# EasyEDA Pro project ProPrj_air-purifier_2025-10-16.epro

# Schematic Schematic1
Board Name: Board1; Create Date: 2025-08-24; Page Name: P1; Project Name: air-purifier; Schematic Name: Schematic1; Update Date: 2025-10-10; Company: EasyEDA.com; Page Size: A4; Version: V1.0
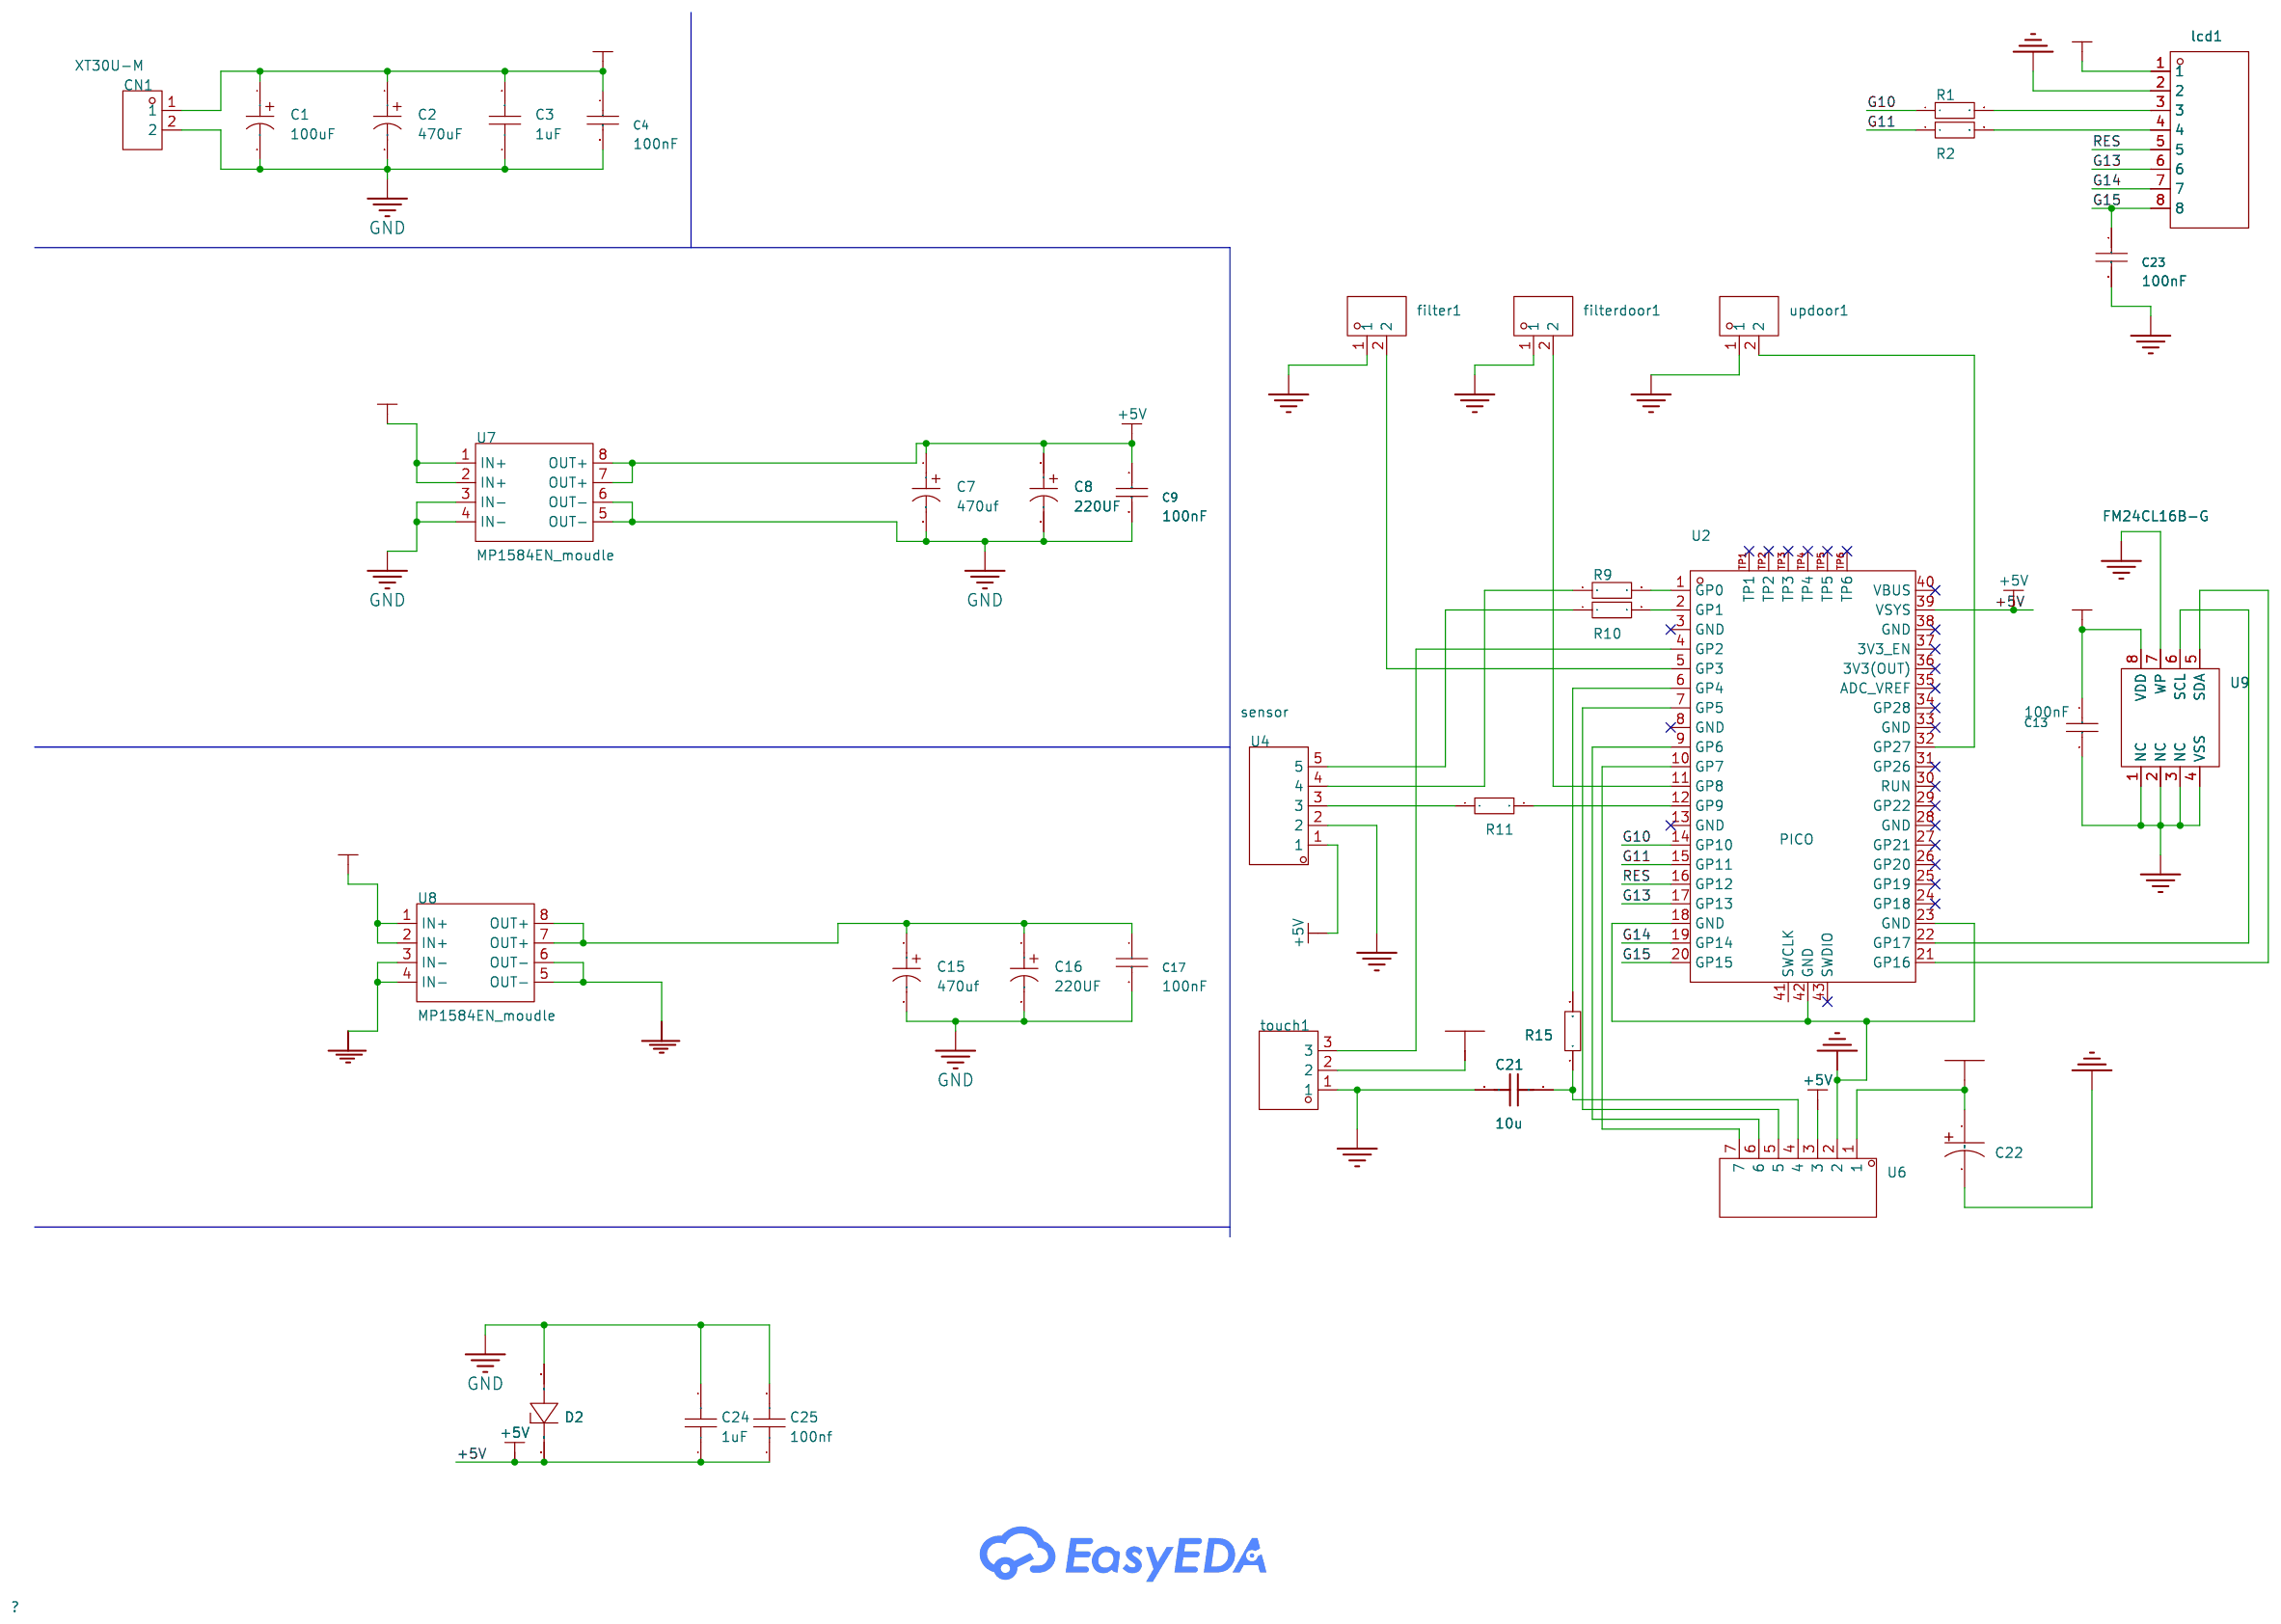
[diagram p0: schematic sheet]

## Parts
C1  100uF  [CAP-TH_BD8.0-P3.50-D0.5-FD]
C2  470uF  [CAP-TH_BD10.0-P5.00-D0.6-FD]
C3  1uF  [RES-SMD_L3.0-W1.5_HOT1206-2W-0R]
C4  100nF  [C1206]
C7  470uf  [CAP-TH_BD10.0-P5.00-D0.6-FD]
C8  220UF  [CAP-TH_BD8.0-P3.50-D0.5-FD]
C9  100nF  [C1206]
C13  100nF  [C1206]
C15  470uf  [CAP-TH_BD10.0-P5.00-D0.6-FD]
C16  220UF  [CAP-TH_BD8.0-P3.50-D0.5-FD]
C17  100nF  [C1206]
C21  10u  [C1206]
C22  1000uF  [CAP-TH_BD13.0-P5.00-D1.2-FD]
C23  100nF  [C1206]
C24  1uF  [C1206]
C25  100nf  [C1206]
CN1  XT30U-M  [CONN-TH_XT30U-M]
D2  SMBJ5.0A-Q  [SMBJ5.0A]
filter1  B2B-PH-K-S  [CONN-TH_B2B-PH-K-S]
filterdoor1  B2B-PH-K-S  [CONN-TH_B2B-PH-K-S]
lcd1  -  [CONN-TH_B8B-PH-K-S-LF-SN]
R1  330Ω  [R1206]
R2  330Ω  [R1206]
R9  1k  [C1206]
R10  1k  [R1206]
R11  10k  [R1206]
R15  1kΩ  [R1206]
touch1  -  [CONN-TH_B3B-PH-KL-LF-SN]
U2  PICO  [todbot_RPI_Pico:RPi_Pico_SMD]
U4  sensor  [CONN-TH_B5B-PH-K-S-LF-SN]
U6  -  [CONN-TH_B7B-PH-K-S-LF-SN]
U7  MP1584EN_moudle  [PWRM-TH_MP1584EN_MOUDLE]
U8  MP1584EN_moudle  [PWRM-TH_MP1584EN_MOUDLE]
U9  FM24CL16B-G  [SOIC-8_L4.9-W3.9-P1.27-LS6.0-BL]
updoor1  B2B-PH-K-S  [CONN-TH_B2B-PH-K-S]

## Library data of the parts
C1 = 100UF50VF120GF: Capacitance:100uF Tolerance:±20% Tolerance:±20% Voltage Rating:50V Ripple Current:550mA@100KHz Equivalent Series Resistance(ESR):170mΩ Pin Spacing:3.5mm Diameter:8mm Height - Seated (Max):12mm Lifetime:4000hrs@105℃ Operating Temperature:-40℃~+105℃ Operati; LCSC Part Name: 100uF ±20% 50V; Supplier Part: C46867072; Manufacturer: Econd(米朗电子); Supplier Footprint: 插件,D8xL12mm; Datasheet: https://atta.szlcsc.com/upload/public/pdf/source/20250321/B9ED006D79D4CBB252CF6B54793BD6AA.pdf; Supplier: LCSC; Tolerance: ±20%; Voltage Rating: 50V; Ripple Current: 550mA@100KHz; Equivalent Series Resistance(ESR): 170mΩ; Pin Spacing: 3.5mm; Diameter: 8mm; Height - Seated (Max): 12mm; Lifetime: 4000hrs@105℃; Operating Temperature: -40℃~+105℃
C2 = 50V470uF CD288: Capacitance:470uF Tolerance:±20% Tolerance:±20% Voltage Rating:50V Pin Spacing:5mm Diameter:10mm Height - Seated (Max):20mm Operating Temperature:-40℃~+105℃ Operating Temperature:-40℃~+105℃; LCSC Part Name: 470uF ±20% 50V; Supplier Part: C2960279; Manufacturer: HRK(鸿瑞凯电子); Supplier Footprint: 插件,D10xL20mm; JLCPCB Part Class: Extended Part; Supplier: LCSC; Tolerance: ±20%; Voltage Rating: 50V; Pin Spacing: 5mm; Diameter: 10mm; Height - Seated (Max): 20mm; Operating Temperature: -40℃~+105℃
C3 C24 C25 = CL31B105KBHNNNE: Capacitance:1uF Tolerance:±10% Tolerance:±10% Voltage Rating:50V Temperature Coefficient:X7R; LCSC Part Name: 1uF ±10% 50V; Supplier Part: C1848; Manufacturer: SAMSUNG(三星); Supplier Footprint: 1206; JLCPCB Part Class: Basic Part; Datasheet: https://item.szlcsc.com/datasheet/CL31B105KBHNNNE/2200.html; Supplier: LCSC; Tolerance: ±10%; Voltage Rating: 50V; Temperature Coefficient: X7R
C4 C9 C13 C17 C23 = CL31B104KBCNNNC: Capacitance:100nF Tolerance:±10% Tolerance:±10% Voltage Rating:50V Temperature Coefficient:X7R; LCSC Part Name: 100nF ±10% 50V; Supplier Part: C24497; Manufacturer: SAMSUNG(三星); Supplier Footprint: 1206; Datasheet: https://item.szlcsc.com/datasheet/CL31B104KBCNNNC/25237.html; Supplier: LCSC; Tolerance: ±10%; Voltage Rating: 50V; Temperature Coefficient: X7R
C7 C8 C15 C16 = 330uF-RB/2.5*6.3: Supplier Part: C9900010440; Supplier Footprint: CAP-TH_BD6.3-P2.50; JLCPCB Part Class: Extended Part; Supplier: LCSC
C21 = 10u: Manufacturer Part: ?; nameAlias: Value(F); spicePre: C; spiceSymbolName: Capacitor
C22 = GR108M050J25RR0VZ2FP0: Lead Spacing: φD: Lifetime @ Temp: Rated Voltage: Tolerance: L: Capacitance: Operating Temperature:- Operating Temperature:-; LCSC Part Name: 1000uF 50V; Supplier Part: C99506; Manufacturer: CX(承兴); Supplier Footprint: 径向引线,13x25mm; JLCPCB Part Class: Extended Part; Datasheet: https://atta.szlcsc.com/upload/public/pdf/source/20180207/C99506_15179953887441359498.pdf; Supplier: LCSC
CN1 = XT30U-M: Power:- Output:- Input:- Size:- Interface:- Type:- Colour:Yellow MaximumCurrent:- Type:Plug RatedVoltage:- Type1:- NumberOfUSBHoles:- InterfaceType:Male MetalMaterial:- InsulationMaterial:- RatedCurrent:- RecommendedWireGauge:- FlameRetardantGrade:- conta; LCSC Part Name: AMASS(艾迈斯)轻量版锂电池插头公头 XT30U-M; Supplier Part: C99101; Manufacturer: AMASS(艾迈斯); JLCPCB Part Class: Extended Part; Datasheet: https://item.szlcsc.com/datasheet/XT30U-M/100314.html; Supplier: LCSC; Type: Plug; Colour: Yellow; InterfaceType: Male
D2 = SMBJ5.0A-Q
filter1 filterdoor1 updoor1 = B2B-PH-K-S: Pins Structure:1x2P Pitch:2mm Mounting Style:Direct Insert Reference Series:PH Number of Pins:2P Number of Rows:1 Number of PINs Per Row:2 Row Spacing:- Current Rating (Max):2A Contact Material:Brass Contact Plating:Tin Operating Temperature Range:-25℃~+8; LCSC Part Name: 1x2P 间距:2mm 直插 系列:PH; Supplier Part: C20504437; Manufacturer: JST; Supplier Footprint: 插件,P=2mm; JLCPCB Part Class: Extended Part; Datasheet: https://atta.szlcsc.com/upload/public/pdf/source/20181010/C265101_22107ACC4D8714694FDA2DD97145FA81.pdf; Supplier: LCSC; Pins Structure: 1x2P; Pitch: 2mm; Mounting Style: Direct Insert; Reference Series: PH; Number of Pins: 2P; Number of Rows: 1; Number of PINs Per Row: 2; Current Rating (Max): 2A; Contact Material: Brass; Contact Plating: Tin; Operating Temperature Range: -25℃~+85℃; Rated Voltage (Max): 100V; Plastic Material: PA66; Flame Retardant Rating: UL94V-0; Supplementary Features: K-leg punch; Colour: White; Z-Height of the Board: 6mm; X-Length of Bottom Edge on Board (Spacing Line): 5.9mm; Y-Width of Bottom Edge on Board: 4.5mm
lcd1 = B8B-XH-A(LF)(SN): Reference Series:XH Pitch:2.5mm Pins Structure:1x8P Number of Rows:1 Number of PINs Per Row:8 Row Spacing:- Mounting Style:- Contact Material:Brass; LCSC Part Name: XH插座 1*8P 直针 间距2.5mm; Supplier Part: C157972; Manufacturer: JST; Supplier Footprint: 插件,P=2.5mm; JLCPCB Part Class: Extended Part; Datasheet: https://atta.szlcsc.com/upload/public/pdf/source/20180319/75EEE5A04AFFC29AA09923EB072E152C.pdf; Supplier: LCSC; Reference Series: XH; Pitch: 2.5mm; Pins Structure: 1x8P; Number of Rows: 1; Number of PINs Per Row: 8; Contact Material: Brass
R1 R2 R9-R11 R15 = RC1206FR-07120KL: Resistance: Operating Temperature Range: Operating Temperature Range: Power(Watts):250mW Body Length:- Tolerance: φD:- Body Height:- Body Width:- Type:Thick Film Resistors Temperature Coefficient: Temperature Coefficient: Overload Voltage (Max):; LCSC Part Name: 120kΩ ±1%; Supplier Part: C163387; Manufacturer: YAGEO(国巨); Supplier Footprint: 1206; JLCPCB Part Class: Extended Part; Datasheet: https://atta.szlcsc.com/upload/public/pdf/source/20180111/C163387_15156543892491258908.pdf; Supplier: LCSC; Power(Watts): 250mW; Type: Thick Film Resistors
touch1 = B3B-ZR(LF)(SN): Reference Series:ZH Pitch:1.5mm Pins Structure:1x3P Number of Rows:1 Number of PINs Per Row:3 Row Spacing:- Mounting Style:- Contact Material:Brass; LCSC Part Name: ZH系列 插座 1*3P 间距1.5mm 直针; Supplier Part: C158001; Manufacturer: JST; Supplier Footprint: 插件,P=1.5mm; JLCPCB Part Class: Extended Part; Datasheet: https://atta.szlcsc.com/upload/public/pdf/source/20180403/C158001_DEF8CA1D6A7E5EA35CC848DFD033606F.pdf; Supplier: LCSC; Reference Series: ZH; Pitch: 1.5mm; Pins Structure: 1x3P; Number of Rows: 1; Number of PINs Per Row: 3; Contact Material: Brass
U2 = PICO: Supplier Part: C7203002; Manufacturer: Raspberry Pi(树莓派); JLCPCB Part Class: Extended Part; Datasheet: https://atta.szlcsc.com/upload/public/pdf/source/20230906/086376002DDC9866828648BC93E51F8B.pdf; Supplier: LCSC
U4 = B5B-PH-K-S(LF)(SN): Pins Structure:1x5P Pitch:2mm Mounting Style:Direct Insert Reference Series:PH Number of Pins:5P Number of Rows:1 Number of PINs Per Row:5 Row Spacing:- Current Rating (Max):2A Contact Material:Brass Contact Plating:Tin Operating Temperature Range:-25℃~+8; LCSC Part Name: 1x5P 间距:2mm 直插 系列:PH; Supplier Part: C157993; Manufacturer: JST; Supplier Footprint: 插件,P=2mm; JLCPCB Part Class: Extended Part; Datasheet: https://atta.szlcsc.com/upload/public/pdf/source/20181010/C265101_22107ACC4D8714694FDA2DD97145FA81.pdf; Supplier: LCSC; Pins Structure: 1x5P; Pitch: 2mm; Mounting Style: Direct Insert; Reference Series: PH; Number of Pins: 5P; Number of Rows: 1; Number of PINs Per Row: 5; Current Rating (Max): 2A; Contact Material: Brass; Contact Plating: Tin; Operating Temperature Range: -25℃~+85℃; Rated Voltage (Max): 100V; Plastic Material: PA66; Flame Retardant Rating: UL94V-0; Supplementary Features: K-leg punch; Colour: White; Z-Height of the Board: 6mm; X-Length of Bottom Edge on Board (Spacing Line): 11.9mm; Y-Width of Bottom Edge on Board: 4.5mm
U6 = B7B-PH-K-S(LF)(SN): Reference Series:PH Pitch:2mm Pins Structure:1x7P Number of Rows:1 Number of PINs Per Row:7 Row Spacing:- Mounting Style:- Contact Material:Brass; LCSC Part Name: PH插座 1*7P 直针 间距2mm; Supplier Part: C157981; Manufacturer: JST; Supplier Footprint: 插件,P=2mm; JLCPCB Part Class: Extended Part; Datasheet: https://atta.szlcsc.com/upload/public/pdf/source/20180531/C157981_0AB98A862CF95B0630A5741FEF846F01.pdf; Supplier: LCSC; Reference Series: PH; Pitch: 2mm; Pins Structure: 1x7P; Number of Rows: 1; Number of PINs Per Row: 7; Contact Material: Brass
U7 U8 = MP1584EN_moudle: Supplier Part: C9900223542; Supplier Footprint: 插件; Supplier: LCSC
U9 = FM24CL16B-G: LCSC Part Name: FM24CL16B G; Supplier Part: C1350846; Supplier Footprint: SOIC-8; JLCPCB Part Class: Extended Part; Supplier: LCSC

## Nets
24V: C1.1 C2.1 C3.2 C4.1 C22.1 CN1.1 U6.1 U7.1(IN+) U7.2(IN+) U8.1(IN+) U8.2(IN+)
+3V3: C13.1 C15.1 C16.1 C17.1 lcd1.1 touch1.2 U8.7(OUT+) U8.8(OUT+) U9.8(VDD)
+5V: C7.1 C8.1 C9.1 C24.1 C25.1 D2.1(CATHODE) U2.39(VSYS) U4.1 U6.3 U7.7(OUT+) U7.8(OUT+)
GND: C1.2 C2.2 C3.1 C4.2 C7.2 C8.2 C9.2 C13.2 C15.2 C16.2 C17.2 C21.2 C22.2 C23.2 C24.2 C25.2 CN1.2 D2.2(ANODE) filter1.1 filterdoor1.1 lcd1.2 touch1.1 U2.18(GND) U2.23(GND) U2.42(GND) U4.2 U6.2 U7.3(IN-) U7.4(IN-) U7.5(OUT-) U7.6(OUT-) U8.3(IN-) U8.4(IN-) U8.5(OUT-) U8.6(OUT-) U9.1(NC) U9.2(NC) U9.3(NC) U9.4(VSS) U9.7(WP) updoor1.1
G10: R1.1 U2.14(GP10)
G11: R2.1 U2.15(GP11)
G13: lcd1.6 U2.17(GP13)
G14: lcd1.7 U2.19(GP14)
G15: C23.1 lcd1.8 U2.20(GP15)
RES: lcd1.5 U2.16(GP12)
$1N4220: filter1.2 U2.5(GP3)
$1N4228: filterdoor1.2 U2.11(GP8)
$1N4378: U2.32(GP27) updoor1.2
$1N4437: R9.1 U4.4
$1N4598: touch1.3 U2.4(GP2)
$1N4710: U2.10(GP7) U6.7
$1N4720: U2.9(GP6) U6.6
$1N4731: U2.7(GP5) U6.5
$1N4885: R10.1 U4.5
$1N4888: R10.2 U2.2(GP1)
$1N4942: R9.2 U2.1(GP0)
$1N4987: R11.2 U2.12(GP9)
$1N4990: R11.1 U4.3
$1N5219: U2.21(GP16) U9.5(SDA)
$1N5233: U2.22(GP17) U9.6(SCL)
$1N7137: lcd1.3 R1.2
$1N7141: lcd1.4 R2.2
$1N8689: R15.2 U2.6(GP4)
$1N8695: C21.1 R15.1 U6.4

Not connected (* = marked no-connect by the designer): U2 3(GND)* 8(GND)* 13(GND)* 24(GP18)* 25(GP19)* 26(GP20)* 27(GP21)* 28(GND)* 29(GP22)* 30(RUN)* 31(GP26)* 33(GND)* 34(GP28)* 35(ADC_VREF)* 36(3V3(OUT))* 37(3V3_EN)* 38(GND)* 40(VBUS)* 41(SWCLK) 43(SWDIO)* TP1* TP2* TP3* TP4* TP5* TP6*

# Board PARTITION1
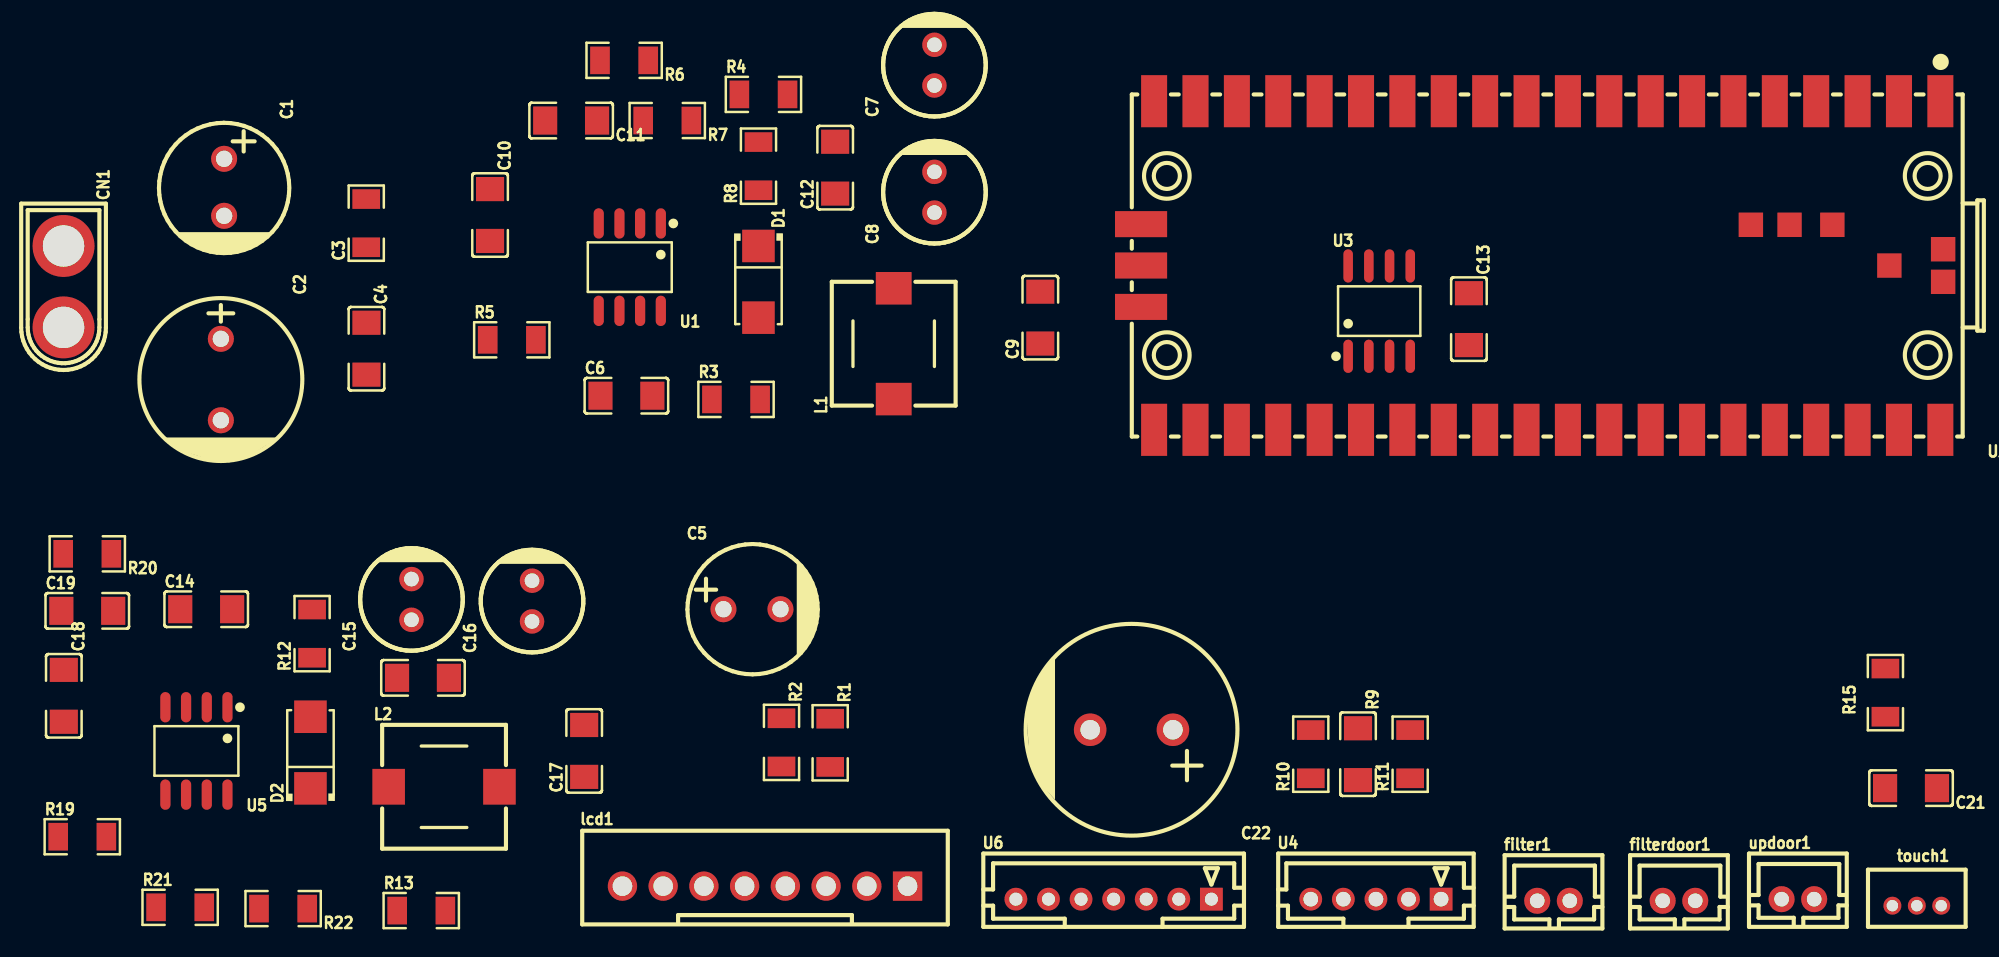
[diagram p1: board, top side]
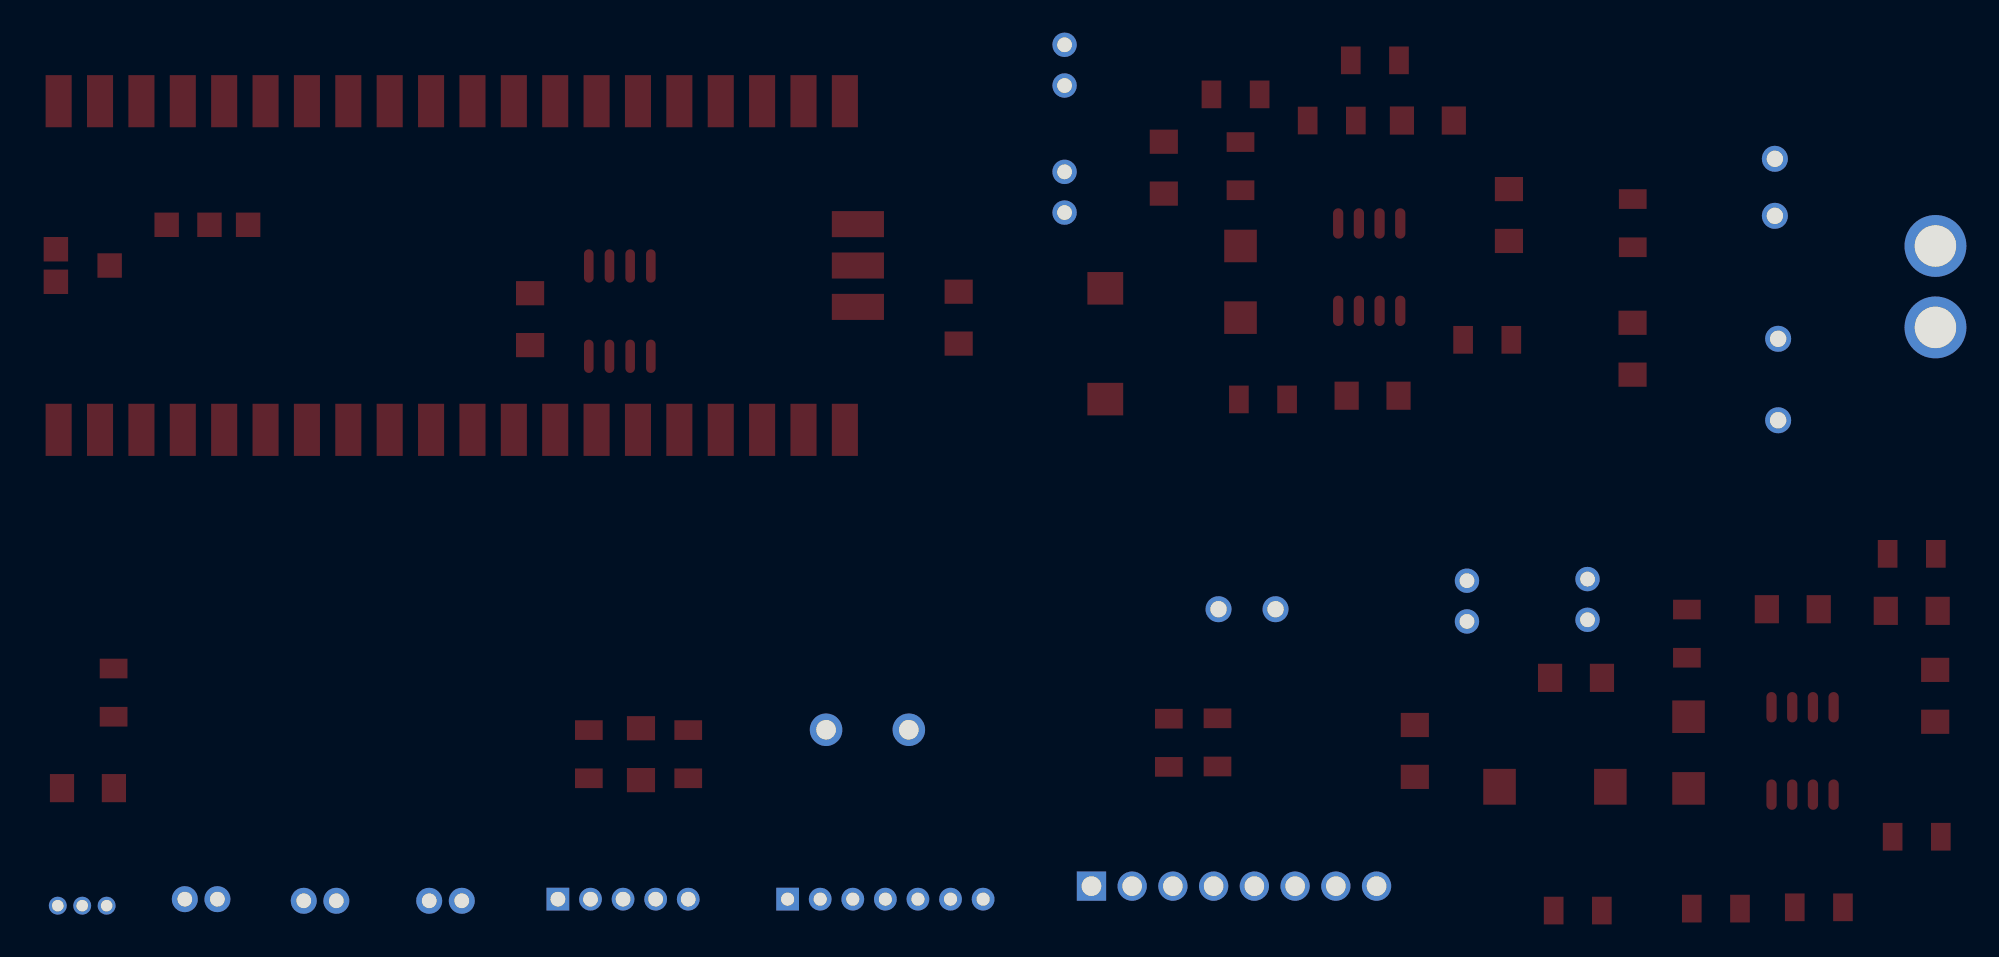
[diagram p2: board, bottom side, seen from below]

No outline. copper layers: Top Layer, Bottom Layer. Coordinates in mm from the lowest, leftmost part position.
Stack: Top Layer 0.035mm / Dielectric1 1.51mm FR4 er 4.5 / Bottom Layer 0.035mm

## Design rules (mm)
template: JLCPCB Capability(Two Layers Board)
spacing copperThickness1oz (default): track to track 0.102, other pairs 0.152 to 0.3
spacing copperThickness2oz: track to track 0.203, other pairs 0.152 to 0.3
track width copperThickness1oz (default): min 0.127, default 0.254, max 2.54
track width copperThickness2oz: min 0.203, default 0.254, max 2.54
differential pair differentialPair (default): width min 0.127, default 0.254, max 2.54; gap min 0.152, default 0.152
via viaSize (default): diameter min 0.5, default 0.61, max 10; hole min 0.3, default 0.305, max 6.3

## Placement (name value [footprint] x y rotation side)
C1  100uF  [CAP-TH_BD8.0-P3.50-D0.5-FD]  9.86 44.4 270 top
C2  470uF  [CAP-TH_BD10.0-P5.00-D0.6-FD]  9.66 32.6 270 top
C3  1uF  [RES-SMD_L3.0-W1.5_HOT1206-2W-0R]  18.58 42.2 90 top
C4  100nF  [C1206]  18.59 34.49 270 top
C5  100uF  [CAP-TH_BD8.0-P3.50-D0.5-FD]  42.26 18.5 0 top
C6  0.1u  [C1206]  34.55 31.61 0 top
C7  470uf  [CAP-TH_BD6.3-P2.50-D0.5-FD]  53.46 51.9 90 top
C8  220UF  [CAP-TH_BD6.3-P2.50-D0.5-FD]  53.46 44.1 90 top
C9  100nF  [C1206]  59.96 36.4 90 top
C10  10u  [C1206]  26.18 42.7 270 top
C11  150pF  [C1206]  31.16 48.5 180 top
C12  10u  [C1206]  47.36 45.61 90 top
C13  100nF  [C1206]  86.26 36.31 270 top
C14  0.1u  [C1206]  8.76 18.5 0 top
C15  470uf  [CAP-TH_BD6.3-P2.50-D0.5-FD]  21.36 19.1 90 top
C16  220UF  [CAP-TH_BD6.3-P2.50-D0.5-FD]  28.76 19 90 top
C17  100nF  [C1206]  31.96 9.8 90 top
C18  10u  [C1206]  0.02 13.18 270 top
C19  150pF  [C1206]  1.46 18.4 0 top
C20  10u  [C1206]  22.06 14.29 180 top
C21  10u  [C1206]  113.4 7.52 180 top
C22  1000uF  [CAP-TH_BD13.0-P5.00-D1.2-FD]  65.56 11.1 180 top
CN1  XT30U-M  [CONN-TH_XT30U-M]  0 38.3 270 top
D1  SS34  [SMA_L4.3-W2.6-LS5.2-RD]  42.66 38.6 270 top
D2  SS34  [SMA_L4.3-W2.6-LS5.2-RD]  15.16 9.7 90 top
filter1  B2B-PH-K-S  [CONN-TH_B2B-PH-K-S]  91.46 0.6 0 top
filterdoor1  B2B-PH-K-S  [CONN-TH_B2B-PH-K-S]  99.16 0.6 0 top
L1  -  [IND-SMD_L7.0-W7.0_SMDRI74-330MT]  50.96 34.8 90 top
L2  -  [IND-SMD_L7.0-W7.0_SMDRI74-330MT]  23.36 7.6 0 top
lcd1  -  [CONN-TH_B8B-XH-A-LF-SN]  43.06 1.5 0 top
R1  330Ω  [R1206]  47.06 10.3 270 top
R2  330Ω  [R1206]  44.07 10.32 270 top
R3  100k  [RES-SMD_L3.0-W1.5_HOT1206-2W-0R]  41.28 31.38 0 top
R4  210k  [RES-SMD_L3.0-W1.5_HOT1206-2W-0R]  42.96 50.11 0 top
R5  100k  [RES-SMD_L3.0-W1.5_HOT1206-2W-0R]  27.51 35.04 0 top
R6  40.2k  [RES-SMD_L3.0-W1.5_HOT1206-2W-0R]  34.41 52.19 180 top
R7  100k  [RES-SMD_L3.0-W1.5_HOT1206-2W-0R]  37.06 48.5 180 top
R8  24.9k  [RES-SMD_L3.0-W1.5_HOT1206-2W-0R]  42.66 45.7 90 top
R9  1k  [C1206]  79.46 9.6 270 top
R10  1k  [R1206]  76.56 9.6 90 top
R11  10k  [R1206]  82.66 9.6 90 top
R12  100k  [R1206]  15.26 17 90 top
R13  210k  [RES-SMD_L3.0-W1.5_HOT1206-2W-0R]  21.96 0 0 top
R15  1kΩ  [R1206]  111.83 13.38 90 top
R19  -  [R1206]  1.15 4.53 0 top
R20  -  [R1206]  1.46 21.9 180 top
R21  -  [R1206]  7.16 0.2 0 top
R22  -  [R1206]  13.48 0.12 180 top
touch1  -  [CONN-TH_B3B-ZR]  113.76 0.3 180 top
U1  MP1584EN-LF-Z  [SOP-8_L4.9-W3.9-P1.27-LS6.0-BL]  34.76 39.5 180 top
U2  PICO  [COMM-SMD_L51.0-W21.0-P2.54_SC0916]  90.76 39.6 180 top
U3  -  [SOIC-8_L4.9-W3.9-P1.27-LS6.0-BL]  80.76 36.8 0 top
U4  sensor  [CONN-TH_B5B-PH-K-S-LF-SN]  80.56 0.7 0 top
U5  MP1584EN-LF-Z  [SOP-8_L4.9-W3.9-P1.27-LS6.0-BL]  8.16 9.8 180 top
U6  -  [CONN-TH_B7B-PH-K-S-LF-SN]  64.46 0.7 0 top
updoor1  B2B-PH-K-S  [CONN-TH_B2B-PH-K-S]  106.46 0.7 0 top

## Footprints (pads in the part's own frame, mm; a bottom-side part is the same pattern mirrored in y, then rotated)
C1206
  rect 1.485x1.728 smd: 1(-1.593,0) 2(1.593,0)
CAP-TH_BD6.3-P2.50-D0.5-FD
  round 1.5 hole 0.9: 1(-1.25,0) 2(1.25,0)
CAP-TH_BD8.0-P3.50-D0.5-FD
  round 1.6 hole 1: 1(-1.75,0) 2(1.75,0)
CAP-TH_BD10.0-P5.00-D0.6-FD
  round 1.6 hole 1: 1(-2.5,0) 2(2.5,0)
CAP-TH_BD13.0-P5.00-D1.2-FD
  round 1.999 hole 1.199: 1(-2.54,0) 2(2.54,0)
COMM-SMD_L51.0-W21.0-P2.54_SC0916
  rect 1.6x3.2 smd: 1(-24.445,-10.088) 2(-21.905,-10.088) 3(-19.365,-10.088) 4(-16.825,-10.088) 5(-14.285,-10.088) 6(-11.745,-10.088) 7(-9.205,-10.088) 8(-6.665,-10.088) 9(-4.125,-10.088) 10(-1.585,-10.088) 11(0.955,-10.088) 12(3.495,-10.088) 13(6.035,-10.088) 14(8.575,-10.088) 15(11.115,-10.088) 16(13.655,-10.088) 17(16.195,-10.088) 18(18.735,-10.088) 19(21.275,-10.088) 20(23.815,-10.088) 21(23.815,10.088) 22(21.275,10.088) 23(18.735,10.088) 24(16.195,10.088) 25(13.655,10.088) 26(11.115,10.088) 27(8.575,10.088) 28(6.035,10.088) 29(3.495,10.088) 30(0.955,10.088) 31(-1.585,10.088) 32(-4.125,10.088) 33(-6.665,10.088) 34(-9.205,10.088) 35(-11.745,10.088) 36(-14.285,10.088) 37(-16.825,10.088) 38(-19.365,10.088) 39(-21.905,10.088) 40(-24.445,10.088)
  rect 3.2x1.6 smd: 41(24.615,-2.54) 42(24.615,0) 43(24.615,2.54)
  rect 1.5x1.5 smd: TP1(-21.315,0) TP2(-24.615,1) TP3(-24.615,-1) TP4(-17.815,-2.5) TP5(-15.188,-2.5) TP6(-12.815,-2.5)
CONN-TH_B2B-PH-K-S
  round 1.6 hole 0.9: 1(1,0) 2(-1,0)
CONN-TH_B3B-ZR
  round 1.1 hole 0.701: 1(-1.498,0) 2(0,0) 3(1.498,0)
CONN-TH_B5B-PH-K-S-LF-SN
  rect 1.4x1.4 hole 0.9: 1(4,0)
  round 1.4 hole 0.9: 2(2,0) 3(0,0) 4(-2,0) 5(-4,0)
CONN-TH_B7B-PH-K-S-LF-SN
  rect 1.4x1.4 hole 0.8: 1(6,0)
  round 1.4 hole 0.8: 2(4,0) 3(2,0) 4(0,0) 5(-2,0) 6(-4,0) 7(-6,0)
CONN-TH_B8B-XH-A-LF-SN
  rect 1.8x1.8 hole 1.2: 1(8.75,0)
  round 1.8 hole 1.2: 2(6.25,0) 3(3.75,0) 4(1.25,0) 5(-1.25,0) 6(-3.75,0) 7(-6.25,0) 8(-8.75,0)
CONN-TH_XT30U-M
  round 3.8 hole 2.54: 1(-2.5,0) 2(2.5,0)
IND-SMD_L7.0-W7.0_SMDRI74-330MT
  rect 1.999x2.2 smd: 1(-3.401,0) 2(3.401,0)
R1206
  rect 1.208x1.701 smd: 1(-1.479,0) 2(1.479,0)
RES-SMD_L3.0-W1.5_HOT1206-2W-0R
  rect 1.208x1.701 smd: 1(-1.479,0) 2(1.479,0)
SMA_L4.3-W2.6-LS5.2-RD
  rect 2x2 smd: 1(-2.2,0) 2(2.2,0)
SOIC-8_L4.9-W3.9-P1.27-LS6.0-BL
  oval 0.588x2.045 smd: 1(-1.905,-2.772) 2(-0.635,-2.772) 3(0.635,-2.772) 4(1.905,-2.772) 5(1.905,2.772) 6(0.635,2.772) 7(-0.635,2.772) 8(-1.905,2.772)
SOP-8_L4.9-W3.9-P1.27-LS6.0-BL
  oval 0.63x1.865 smd: 1(-1.905,-2.683) 2(-0.635,-2.683) 3(0.635,-2.683) 4(1.905,-2.683) 5(1.905,2.683) 6(0.635,2.683) 7(-0.635,2.683) 8(-1.905,2.683)

## Nets
24V: C1.1 C2.1 C3.2 C4.1 C10.1 C18.1 C22.1 CN1.1 R3.1 R12.1 U1.7 U5.7 U6.1
+3V3: C15.1 C16.1 C17.1 C20.1 L2.2 lcd1.1 R13.2 touch1.2
+5V: C7.1 C8.1 C9.1 C12.1 L1.2 R4.2 U4.1 U6.3
GND: C1.2 C2.2 C3.1 C4.2 C5.2 C7.2 C8.2 C9.2 C10.2 C12.2 C13.2 C15.2 C16.2 C17.2 C18.2 C20.2 C21.1 C22.2 CN1.2 D1.1 D2.1 filter1.1 filterdoor1.1 lcd1.2 R5.1 R6.1 R7.1 R8.2 R19.1 R20.1 R21.1 R22.1 touch1.1 U1.5 U2.18 U2.23 U2.42 U3.1 U3.2 U3.3 U3.4 U3.7 U4.2 U5.5 U6.2 updoor1.1
G10: R1.1 U2.14
G11: R2.1 U2.15
G13: lcd1.6 U2.17
G14: lcd1.7 U2.19
G15: C5.1 lcd1.8 U2.20
RES: lcd1.5 U2.16
$1N503: R5.2 U1.6
$1N506: C6.2 D1.2 L1.1 U1.1
$1N507: R4.1 R6.2 U1.4
$1N510: C6.1 U1.8
$1N511: R3.2 R8.1 U1.2
$1N512: C11.2 U1.3
$1N513: C11.1 R7.2
$1N1843: R13.1 R22.2 U5.4
$1N1844: R12.2 R21.2 U5.2
$1N1852: C14.2 D2.2 L2.1 U5.1
$1N1854: C14.1 U5.8
$1N1855: C19.2 U5.3
$1N1856: R19.2 U5.6
$1N4220: filter1.2 U2.5
$1N4228: filterdoor1.2 U2.11
$1N4378: U2.32 updoor1.2
$1N4437: R9.1 U4.4
$1N4598: touch1.3 U2.4
$1N4710: U2.10 U6.7
$1N4720: U2.9 U6.6
$1N4731: U2.7 U6.5
$1N4885: R10.1 U4.5
$1N4888: R10.2 U2.2
$1N4942: R9.2 U2.1
$1N4987: R11.2 U2.12
$1N4990: R11.1 U4.3
$1N5164: C13.1 U3.8
$1N5219: U2.21 U3.5
$1N5233: U2.22 U3.6
$1N7137: lcd1.3 R1.2
$1N7141: lcd1.4 R2.2
$1N8689: R15.2 U2.6
$1N8695: C21.2 R15.1 U6.4
$1N10094: C19.1 R20.2

Pads without a net: U2 3 8 13 24 25 26 27 28 29 30 31 33 34 35 36 37 38 39 40 41 43 TP1 TP2 TP3 TP4 TP5 TP6

# Board PCB2
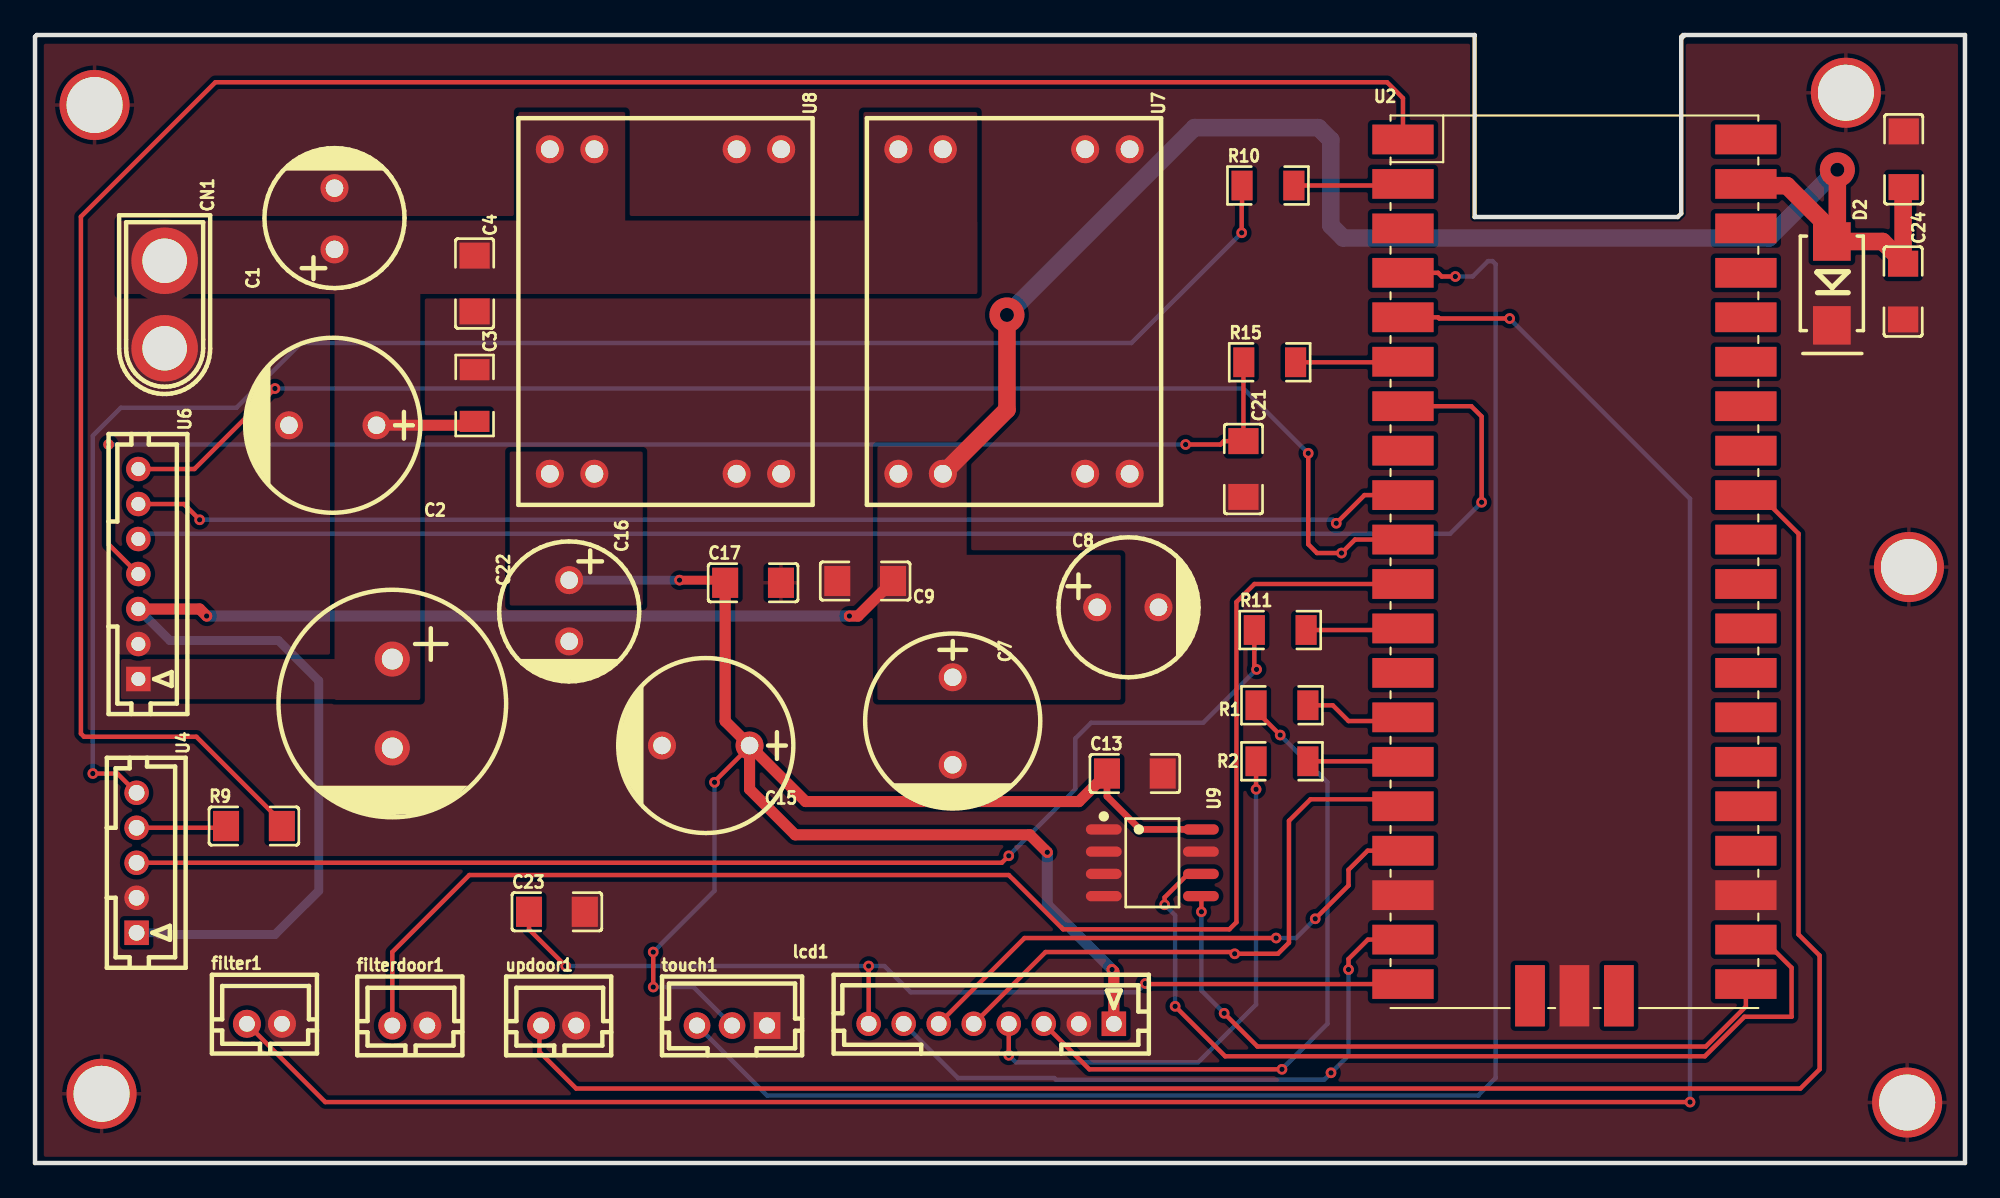
[diagram p3: board, top side]
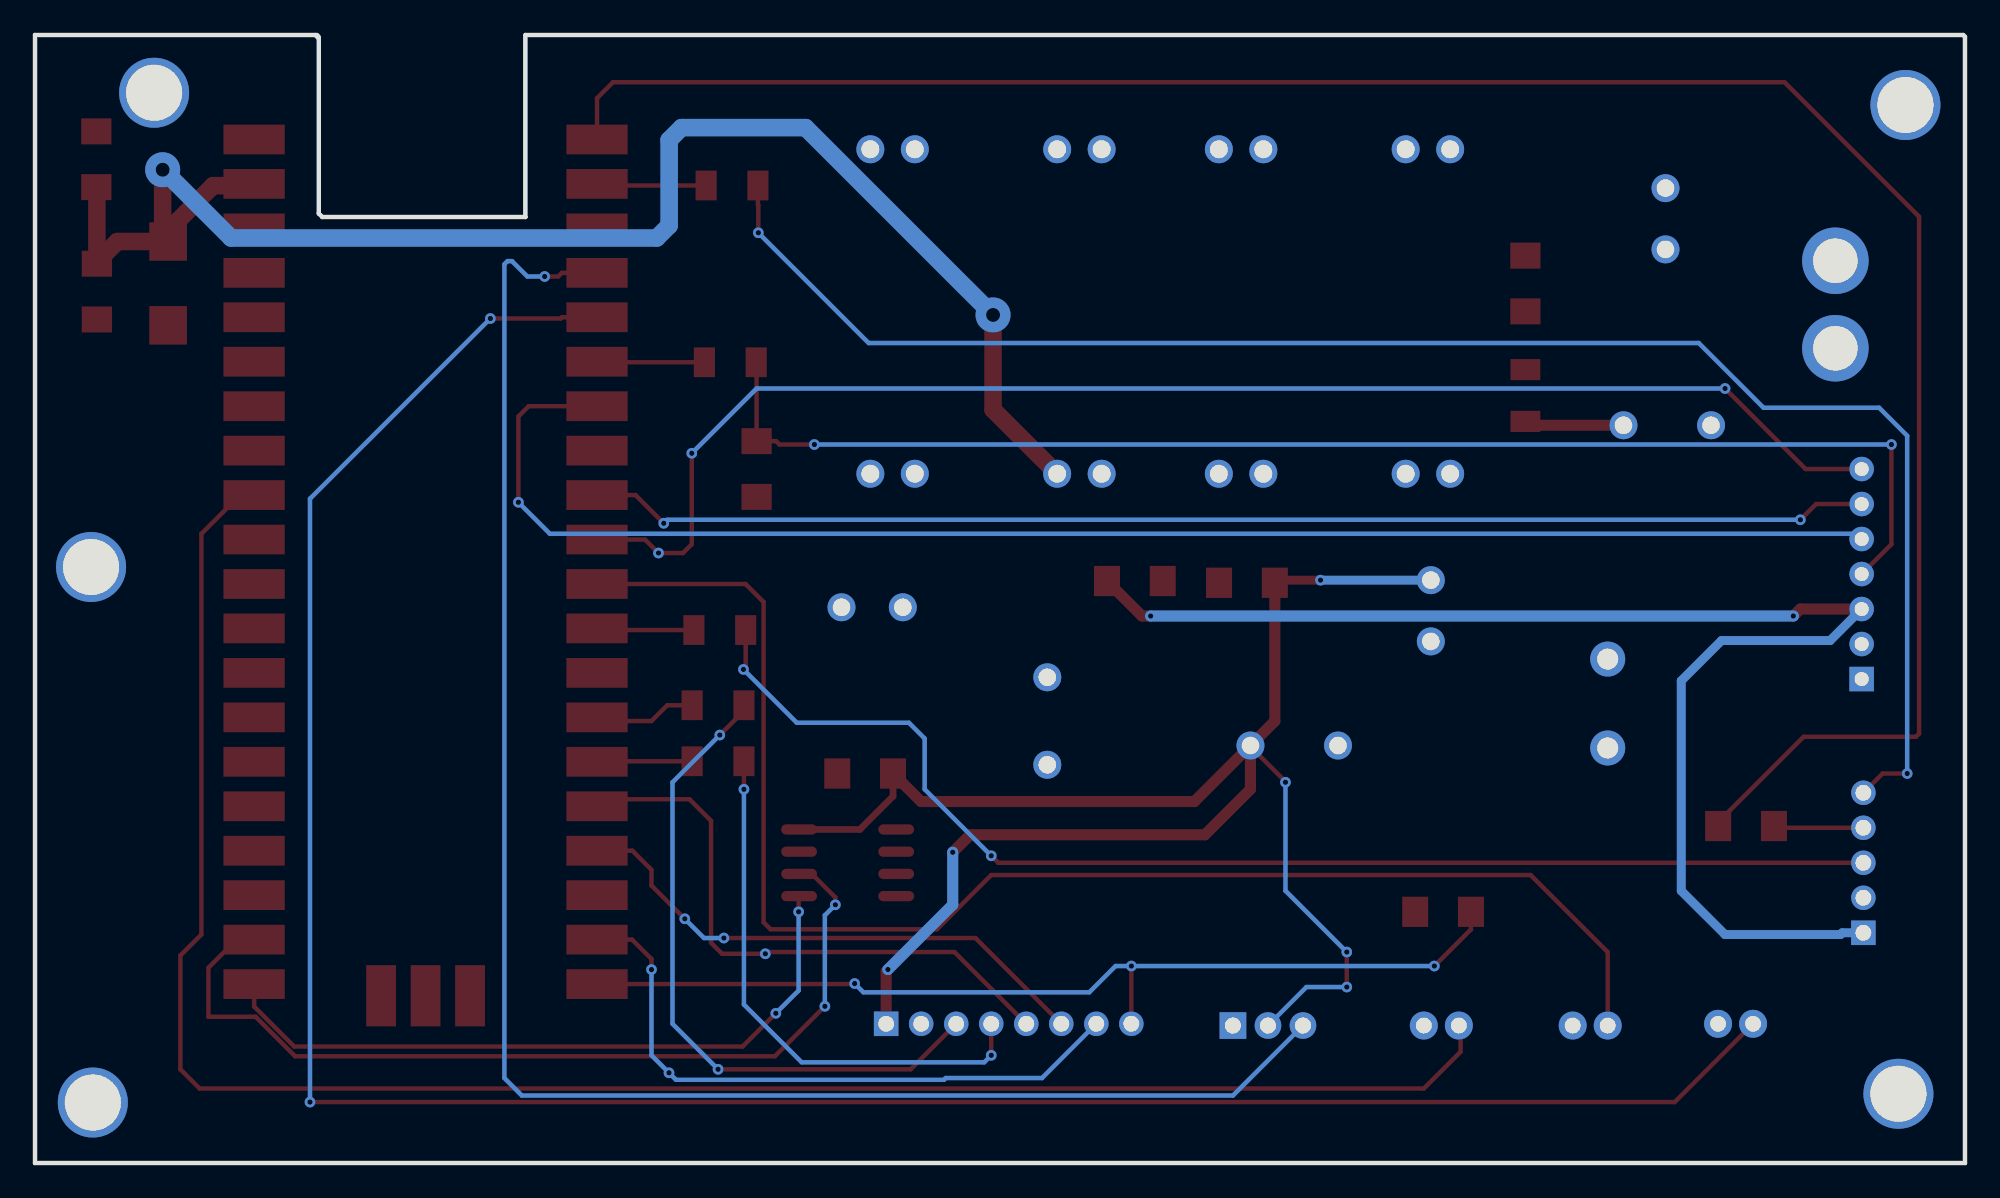
[diagram p4: board, bottom side, seen from below]

Outline 110.2 x 64.45 mm; copper layers: Top Layer, Bottom Layer. Coordinates in mm from the lower left corner of the outline.
Outline path: 94.1,64.45 94,64.35 ; 0,64.35 0,0 110.2,0 110.2,64.45 94.2,64.45 94,64.25 94,54.25 93.8,54.05 82.2,54.05 82.2,64.45 0.1,64.45 0,64.35
Stack: Top Layer 0.035mm / Dielectric1 1.51mm FR4 er 4.5 / Bottom Layer 0.035mm

## Design rules (mm)
template: JLCPCB Capability(Two Layers Board)
spacing copperThickness1oz (default): track to track 0.102, other pairs 0.152 to 0.3
spacing copperThickness2oz: track to track 0.203, other pairs 0.152 to 0.3
track width copperThickness1oz (default): min 0.127, default 0.254, max 2.54
track width copperThickness2oz: min 0.203, default 0.254, max 2.54
differential pair differentialPair (default): width min 0.127, default 0.254, max 2.54; gap min 0.152, default 0.152
via viaSize (default): diameter min 0.5, default 0.61, max 10; hole min 0.3, default 0.305, max 6.3

## Placement (name value [footprint] x y rotation side)
C1  100uF  [CAP-TH_BD8.0-P3.50-D0.5-FD]  17.1 53.95 90 top
C2  470uF  [CAP-TH_BD10.0-P5.00-D0.6-FD]  17 42.15 180 top
C3  1uF  [RES-SMD_L3.0-W1.5_HOT1206-2W-0R]  25.1 43.85 270 top
C4  100nF  [C1206]  25.1 50.25 270 top
C7  470uf  [CAP-TH_BD10.0-P5.00-D0.6-FD]  52.4 25.25 270 top
C8  220UF  [CAP-TH_BD8.0-P3.50-D0.5-FD]  62.4 31.75 0 top
C9  100nF  [C1206]  47.4 33.25 180 top
C13  100nF  [C1206]  62.8 22.25 0 top
C15  470uf  [CAP-TH_BD10.0-P5.00-D0.6-FD]  38.3 23.85 180 top
C16  220UF  [CAP-TH_BD8.0-P3.50-D0.5-FD]  30.5 31.55 270 top
C17  100nF  [C1206]  41 33.15 0 top
C21  10u  [C1206]  69 39.65 270 top
C22  1000uF  [CAP-TH_BD13.0-P5.00-D1.2-FD]  20.4 26.25 270 top
C23  100nF  [C1206]  29.8 14.35 0 top
C24  1uF  [C1206]  106.67 49.79 270 top
C25  100nf  [C1206]  106.7 57.35 90 top
CN1  XT30U-M  [CONN-TH_XT30U-M]  7.4 49.05 270 top
D2  SMBJ5.0A-Q  [SMBJ5.0A]  102.6 52.65 270 top
filter1  B2B-PH-K-S  [CONN-TH_B2B-PH-K-S]  13.1 7.95 0 top
filterdoor1  B2B-PH-K-S  [CONN-TH_B2B-PH-K-S]  21.4 7.85 0 top
lcd1  -  [CONN-TH_B8B-PH-K-S-LF-SN]  54.6 7.95 0 top
NOREF  -  [Pad_e1723]  106.9 3.45 270 top
NOREF#2  -  [Pad_e1724]  103.4 61.15 270 top
NOREF#3  -  [Pad_e1616]  3.4 60.45 270 top
NOREF#4  -  [Pad_e1619]  3.8 3.95 270 top
NOREF#5  -  [Pad_e1725]  107 34.05 270 top
R1  330Ω  [R1206]  71.2 26.15 180 top
R2  330Ω  [R1206]  71.2 22.95 180 top
R9  1k  [C1206]  12.5 19.25 0 top
R10  1k  [R1206]  70.4 55.85 0 top
R11  10k  [R1206]  71.1 30.45 0 top
R15  1kΩ  [R1206]  70.5 45.75 0 top
touch1  -  [CONN-TH_B3B-PH-KL-LF-SN]  39.8 7.85 0 top
U2  PICO  [todbot_RPI_Pico:RPi_Pico_SMD]  87.9 34.35 0 top
U4  sensor  [CONN-TH_B5B-PH-K-S-LF-SN]  5.8 17.15 270 top
U6  -  [CONN-TH_B7B-PH-K-S-LF-SN]  5.9 33.65 270 top
U7  MP1584EN_moudle  [PWRM-TH_MP1584EN_MOUDLE]  55.9 48.65 270 top
U8  MP1584EN_moudle  [PWRM-TH_MP1584EN_MOUDLE]  36 48.65 270 top
U9  FM24CL16B-G  [SOIC-8_L4.9-W3.9-P1.27-LS6.0-BL]  63.8 17.15 270 top
updoor1  B2B-PH-K-S  [CONN-TH_B2B-PH-K-S]  29.9 7.85 0 top

## Footprints (pads in the part's own frame, mm; a bottom-side part is the same pattern mirrored in y, then rotated)
C1206
  rect 1.485x1.728 smd: 1(-1.593,0) 2(1.593,0)
CAP-TH_BD8.0-P3.50-D0.5-FD
  round 1.6 hole 1: 1(-1.75,0) 2(1.75,0)
CAP-TH_BD10.0-P5.00-D0.6-FD
  round 1.6 hole 1: 1(-2.5,0) 2(2.5,0)
CAP-TH_BD13.0-P5.00-D1.2-FD
  round 1.999 hole 1.199: 1(-2.54,0) 2(2.54,0)
CONN-TH_B2B-PH-K-S
  round 1.6 hole 0.9: 1(1,0) 2(-1,0)
CONN-TH_B3B-PH-KL-LF-SN
  rect 1.524x1.524 hole 0.914: 1(2,0)
  round 1.524 hole 0.914: 2(0,0) 3(-2,0)
CONN-TH_B5B-PH-K-S-LF-SN
  rect 1.4x1.4 hole 0.9: 1(4,0)
  round 1.4 hole 0.9: 2(2,0) 3(0,0) 4(-2,0) 5(-4,0)
CONN-TH_B7B-PH-K-S-LF-SN
  rect 1.4x1.4 hole 0.8: 1(6,0)
  round 1.4 hole 0.8: 2(4,0) 3(2,0) 4(0,0) 5(-2,0) 6(-4,0) 7(-6,0)
CONN-TH_B8B-PH-K-S-LF-SN
  rect 1.4x1.4 hole 0.9: 1(7,0)
  round 1.4 hole 0.9: 2(5,0) 3(3,0) 4(1,0) 5(-1,0) 6(-3,0) 7(-5,0) 8(-7,0)
CONN-TH_XT30U-M
  round 3.8 hole 2.54: 1(-2.5,0) 2(2.5,0)
Pad_e1616
  round 4 hole 3.2: 1(0,0)
Pad_e1619
  round 4 hole 3.2: 1(0,0)
Pad_e1723
  round 4 hole 3.2: 1(0,0)
Pad_e1724
  round 4 hole 3.2: 1(0,0)
Pad_e1725
  round 4 hole 3.2: 1(0,0)
PWRM-TH_MP1584EN_MOUDLE
  round 1.6 hole 1.02: 1(-9.271,-6.604) 2(-9.271,-4.064) 3(-9.271,4.064) 4(-9.271,6.604) 5(9.271,6.604) 6(9.271,4.064) 7(9.271,-4.064) 8(9.271,-6.604)
R1206
  rect 1.208x1.701 smd: 1(-1.479,0) 2(1.479,0)
RES-SMD_L3.0-W1.5_HOT1206-2W-0R
  rect 1.208x1.701 smd: 1(-1.479,0) 2(1.479,0)
SMBJ5.0A
  rect 2.2x2.15 smd: 1(0,0) 2(4.79,0)
SOIC-8_L4.9-W3.9-P1.27-LS6.0-BL
  oval 0.588x2.045 smd: 1(-1.905,-2.772) 2(-0.635,-2.772) 3(0.635,-2.772) 4(1.905,-2.772) 5(1.905,2.772) 6(0.635,2.772) 7(-0.635,2.772) 8(-1.905,2.772)
todbot_RPI_Pico:RPi_Pico_SMD
  rect 3.5x1.7 smd: 1(-9.79,24.13) 2(-9.79,21.59) 3(-9.79,19.05) 4(-9.79,16.51) 5(-9.79,13.97) 6(-9.79,11.43) 7(-9.79,8.89) 8(-9.79,6.35) 9(-9.79,3.81) 10(-9.79,1.27) 11(-9.79,-1.27) 12(-9.79,-3.81) 13(-9.79,-6.35) 14(-9.79,-8.89) 15(-9.79,-11.43) 16(-9.79,-13.97) 17(-9.79,-16.51) 18(-9.79,-19.05) 19(-9.79,-21.59) 20(-9.79,-24.13) 21(9.79,-24.13) 22(9.79,-21.59) 23(9.79,-19.05) 24(9.79,-16.51) 25(9.79,-13.97) 26(9.79,-11.43) 27(9.79,-8.89) 28(9.79,-6.35) 29(9.79,-3.81) 30(9.79,-1.27) 31(9.79,1.27) 32(9.79,3.81) 33(9.79,6.35) 34(9.79,8.89) 35(9.79,11.43) 36(9.79,13.97) 37(9.79,16.51) 38(9.79,19.05) 39(9.79,21.59) 40(9.79,24.13)
  rect 1.7x3.5 smd: 41(-2.54,-24.8) 42(0,-24.8) 43(2.54,-24.8)

## Nets
As in the schematic, except:
GND: C1.2 C2.2 C3.1 C4.2 C7.2 C8.2 C9.2 C13.2 C15.2 C16.2 C17.2 C21.2 C22.2 C23.2 C24.2 C25.2 CN1.2 D2.2 filter1.1 filterdoor1.1 lcd1.2 NOREF.1 NOREF#2.1 NOREF#3.1 NOREF#4.1 NOREF#5.1 touch1.1 U2.18 U2.23 U2.42 U4.2 U6.2 U7.3 U7.4 U7.5 U7.6 U8.3 U8.4 U8.5 U8.6 U9.1 U9.2 U9.3 U9.4 U9.7 updoor1.1

Pads without a net: U2 3 8 13 24 25 26 27 28 29 30 31 33 34 35 36 37 38 40 41 43

## Via types
v1: diameter 2, hole 0.8, Top Layer to Bottom Layer, 2 vias
v2: diameter 0.61, hole 0.305, Top Layer to Bottom Layer, 39 vias

## Routing (per net, layer and track width the routed paths; a pad name or vN(x,y) marks a point on that pad's centre or on a via; arc(x,y) is an arc through that point)
24V: length 5.8
  Top Layer w0.635: 25.1,42.58 24.68,42.15 C2.1
+3V3: length 102.4
  Top Layer w0.254: 40.8,23.55 40.56,23.55 38.8,21.8 v2(38.8,21.75) ; v2(35.3,10.05) v2(35.3,12.05)
  Top Layer w0.381: U9.8 63.1,19.06 61.21,20.95 C13.1
  Top Layer w0.508: v2(36.8,33.3) 39.26,33.3 C17.1
  Top Layer w0.635: v2(57.8,17.75) 56.8,18.75 43.4,18.75 40.8,21.35 C15.1 ; C13.1 59.61,20.65 44,20.65 C15.1 ; C15.1 39.41,25.25 C17.1 ; v2(61.5,11.05) 61.6,10.95 lcd1.1
  Bottom Layer w0.254: touch1.2 37.6,10.05 v2(35.3,10.05) ; v2(38.8,21.75) 38.8,15.55 v2(35.3,12.05)
  Bottom Layer w0.508: C16.1 v2(36.8,33.3)
  Bottom Layer w0.635: v2(57.8,17.75) 57.8,14.75 v2(61.5,11.05)
+5V: length 168.3
  Top Layer w0.635: v2(46.5,31.25) 46.99,31.25 C9.1 ; v2(9.8,31.25) 9.4,31.65 U6.3
  Top Layer w1: v1(55.5,48.46) 55.5,43.04 U7.7 ; 106.67,51.49 105.5,52.65 103.22,52.65 ; 106.67,51.49 C24.1 ; 106.67,51.49 106.67,55.73 C25.1 ; v1(102.91,56.75) 102.91,53.05 ; 102.91,52.97 100.03,55.84 97.79,55.84 U2.39 ; 102.91,52.97 103,53.05 ; 102.91,52.97 D2.1
  Bottom Layer w0.508: U4.1 7.01,13.15 7.11,13.05 13.7,13.05 16.2,15.55 16.2,27.55 13.9,29.85 7.7,29.85 U6.3
  Bottom Layer w0.635: v2(46.5,31.25) v2(9.8,31.25)
  Bottom Layer w1: v1(55.5,48.46) 66.2,59.16 73.29,59.16 73.99,58.45 73.99,53.56 74.7,52.85 99,52.85 102.91,56.77 ; v1(102.91,56.75) 102.91,56.77 ; 102.91,56.77 103,56.85
G10: length 5.9
  Top Layer w0.254: R1.1 74.1,26.15 75,25.25 77.9,25.25 U2.14
G11: length 5.4
  Top Layer w0.254: R2.1 78.08,22.95 U2.15
G13: length 31.1
  Top Layer w0.254: lcd1.6 56.5,12.85 v2(70.87,12.85) ; v2(73.1,13.95) 75,15.85 75,16.75 76.09,17.84 U2.17
  Bottom Layer w0.254: v2(70.87,12.85) 72,12.85 v2(73.1,13.95)
G14: length 36.4
  Top Layer w0.254: U2.19 76.11,12.76 75,11.66 v2(75,11.05)
  Bottom Layer w0.254: lcd1.7 52.7,4.85 58.2,4.85 58.3,4.75 73.6,4.75 v2(74,5.15) 75,6.15 v2(75,11.05)
G15: length 55.9
  Top Layer w0.254: v2(30.3,11.25) 28.21,13.35 C23.1 ; lcd1.8 v2(47.6,11.25) ; U2.20 63.43,10.22 v2(63.4,10.25)
  Bottom Layer w0.254: v2(63.4,10.25) 62.9,9.75 50,9.75 48.5,11.25 v2(47.6,11.25) v2(30.3,11.25)
RES: length 34.2
  Top Layer w0.254: lcd1.5 57.7,12.05 68.4,12.05 v2(68.5,11.95) 70.97,11.95 71.6,12.59 71.6,19.55 72.83,20.78 77.71,20.78 U2.16
$1N4220: length 139.4
  Top Layer w0.254: filter1.2 16.57,3.48 v2(94.5,3.48) ; v2(84.2,48.25) 80.18,48.25 80.11,48.32 U2.5
  Bottom Layer w0.254: v2(84.2,48.25) 94.5,37.95 v2(94.5,3.48)
$1N4228: length 83.9
  Top Layer w0.254: filterdoor1.2 20.4,12.05 24.8,16.45 55.6,16.45 58.7,13.35 68.2,13.35 68.6,13.75 68.6,32.05 69.63,33.08 U2.11
$1N4378: length 111
  Top Layer w0.254: U2.32 98.49,38.16 100.7,35.95 100.7,13.05 101.9,11.85 101.9,5.35 100.8,4.25 30.9,4.25 28.8,6.35 28.8,7.75 updoor1.2
$1N4437: length 5.3
  Top Layer w0.254: 11.11,19.15 U4.4
$1N4598: length 100
  Top Layer w0.254: U2.4 80.11,50.86 80.32,50.65 v2(81.1,50.65)
  Bottom Layer w0.254: v2(81.1,50.65) 82.09,50.65 82.97,51.53 83.22,51.53 83.4,51.35 83.4,4.85 82.4,3.85 41.8,3.85 touch1.3
$1N4710: length 81.4
  Top Layer w0.254: v2(72.7,40.55) 72.7,35.35 73.2,34.85 v2(74.6,34.85) 75.37,35.62 U2.10 ; v2(13.7,44.25) 9.1,39.65 U6.7
  Bottom Layer w0.254: v2(13.7,44.25) 69,44.25 v2(72.7,40.55)
$1N4720: length 73.3
  Top Layer w0.254: v2(9.4,36.75) 8.5,37.65 U6.6 ; U2.9 75.91,38.16 v2(74.3,36.55)
  Bottom Layer w0.254: v2(9.4,36.75) 74.1,36.75 v2(74.3,36.55)
$1N4731: length 87.2
  Top Layer w0.254: U2.7 82.01,43.24 82.6,42.65 v2(82.6,37.75)
  Bottom Layer w0.254: U6.5 6.2,35.95 80.8,35.95 v2(82.6,37.75)
$1N4885: length 95.4
  Top Layer w0.254: v2(68.9,53.15) 68.9,54.73 68.92,54.75 R10.1 ; v2(3.3,22.25) 4.7,22.25 U4.5
  Bottom Layer w0.254: v2(68.9,53.15) 62.6,46.85 15.2,46.85 11.5,43.15 4.9,43.15 3.3,41.55 v2(3.3,22.25)
$1N4888: length 6.3
  Top Layer w0.254: U2.2 78.02,55.85 R10.2
$1N4942: length 124.9
  Top Layer w0.254: U2.1 78.11,60.84 77.2,61.75 10.3,61.75 2.62,54.08 2.62,24.53 2.8,24.35 9.21,24.35 14.29,19.28 14.29,19.15
$1N4987: length 5.6
  Top Layer w0.254: R11.2 78.02,30.45 U2.12
$1N4990: length 72.5
  Top Layer w0.254: U4.3 55.2,17.15 v2(55.6,17.55) ; v2(69.75,28.2) 69.62,28.33 R11.1
  Bottom Layer w0.254: v2(69.75,28.2) 66.7,25.15 60.3,25.15 59.4,24.25 59.4,21.35 v2(55.6,17.55)
$1N5219: length 40.1
  Top Layer w0.254: v2(67.9,8.55) 69.8,6.65 95.4,6.65 97.69,8.94 U2.21 ; v2(66.6,14.35) 66.6,15.22 U9.5
  Bottom Layer w0.254: v2(67.9,8.55) 66.6,9.85 v2(66.6,14.35)
$1N5233: length 52.5
  Top Layer w0.254: v2(64.5,14.75) 64.5,15.18 65.84,16.52 U9.6 ; v2(65.1,8.95) 67.96,6.1 95.35,6.1 97.6,8.35 100.3,8.35 100.3,11.16 98.69,12.76 U2.22
  Bottom Layer w0.254: v2(64.5,14.75) 65.1,14.15 v2(65.1,8.95)
$1N7137: length 38.2
  Top Layer w0.254: R1.2 69.72,25.83 v2(71.1,24.45) ; v2(71.2,5.35) 60.2,5.35 lcd1.3
  Bottom Layer w0.254: v2(71.2,5.35) 73.8,7.95 73.8,21.75 v2(71.1,24.45)
$1N7141: length 31.4
  Top Layer w0.254: v2(55.6,6.15) lcd1.4 ; v2(69.72,21.35) R2.2
  Bottom Layer w0.254: v2(69.72,21.35) 69.72,9.05 66.42,5.75 56,5.75 v2(55.6,6.15)
$1N8689: length 6.1
  Top Layer w0.254: R15.2 78.08,45.75 U2.6
$1N8695: length 77.5
  Top Layer w0.254: U6.4 4.2,35.35 v2(4.2,41.05) ; v2(65.7,41.05) 67.69,41.05 67.88,41.25 C21.1 69,45.73 R15.1
  Bottom Layer w0.254: v2(4.2,41.05) v2(65.7,41.05)

## Copper pours and planes (outline as drawn; the poured copper is in the pictures)
24V on Top Layer: 4.9,28.79 21.9,28.79 21.9,26.5 4.9,26.5
24V on Top Layer: 17.1,52.95 22,52.95 22,26.45 17.1,26.45
24V on Top Layer: 4.8,53.85 53.8,53.85 53.8,49.65 4.8,49.65
24V on Top Layer: 27.6,60.06 33.7,60.06 33.7,49.75 27.6,49.75
24V on Top Layer: 47.3,60.05 53.8,60.05 53.8,49.65 47.3,49.65
+3V3 on Top Layer: 27.1,40.65 34.7,40.65 34.7,31.85 27.1,31.85
+5V on Top Layer: 48.5,34.75 62,34.75 62,26.45 48.5,26.45
+5V on Top Layer: 48.1,40.95 53.2,40.95 53.2,26.45 48.1,26.45
GND on Top Layer: 0.5,63.95 109.8,63.95 109.8,0.35 0.5,0.35
